# EAGLE design A4989 (EAGLE 7.7.0)
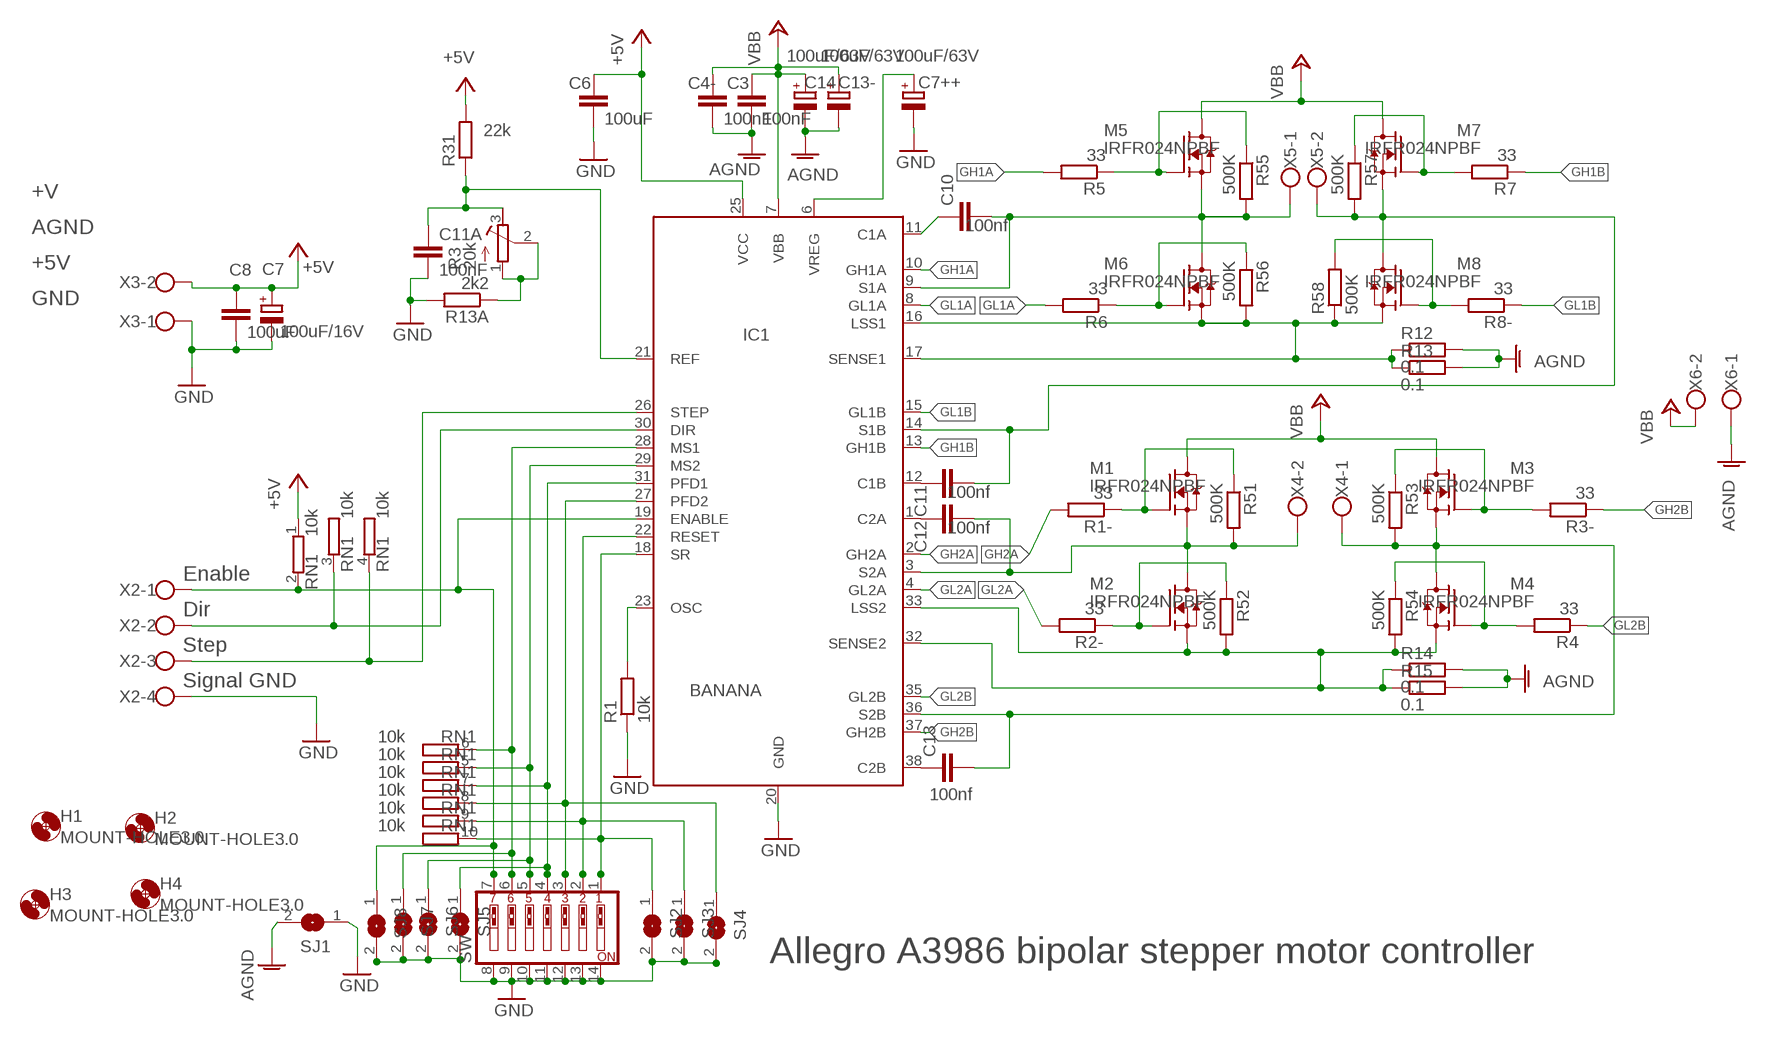
[diagram p0: schematic, sheet 1]

## Parts
C3  100nF  C-EUC0805  [C0805]
C4-  100nF  C-EUC0805  [C0805]
C6  100uF  C-EUC0805  [C0805]
C7  100uF/16V  CPOL-EUE5-10.5  [E5-10,5]
C7++  100uF/63V  CPOL-EUE2-5  [E2-5]
C8  100uF  C-EUC0805  [C0805]
C10  100nf  C-EUC0805  [C0805]
C11  100nf  C-EUC0805  [C0805]
C11A  100nF  C-EUC0805  [C0805]
C12  100nf  C-EUC0805  [C0805]
C13  100nf  C-EUC0805  [C0805]
C13-  100uF/63V  CPOL-EUE5-10.5  [E5-10,5]
C14  100uF/63V  CPOL-EUE5-10.5  [E5-10,5]
H1  MOUNT-HOLE3.0  [3,0]
H2  MOUNT-HOLE3.0  [3,0]
H3  MOUNT-HOLE3.0  [3,0]
H4  MOUNT-HOLE3.0  [3,0]
IC1  BANANA  A3986  [TSSOP38]
M1  IRFR024NPBF  [DPAK]
M2  IRFR024NPBF  [DPAK]
M3  IRFR024NPBF  [DPAK]
M4  IRFR024NPBF  [DPAK]
M5  IRFR024NPBF  [DPAK]
M6  IRFR024NPBF  [DPAK]
M7  IRFR024NPBF  [DPAK]
M8  IRFR024NPBF  [DPAK]
R1  10k  R-EU_M0805  [M0805]
R1-  33  R-EU_R0805  [R0805]
R2-  33  R-EU_R0805  [R0805]
R3  20k  R-TRIMM64W  [RTRIM64W]
R3-  33  R-EU_R0805  [R0805]
R4  33  R-EU_R0805  [R0805]
R5  33  R-EU_R0805  [R0805]
R6  33  R-EU_R0805  [R0805]
R7  33  R-EU_R0805  [R0805]
R8-  33  R-EU_R0805  [R0805]
R12  0.1  R-EU_R2512  [R2512]
R13  0.1  R-EU_R2512  [R2512]
R13A  2k2  R-EU_M0805  [M0805]
R14  0.1  R-EU_R2512  [R2512]
R15  0.1  R-EU_R2512  [R2512]
R31  22k  R-EU_M0805  [M0805]
R51  500K  R-EU_R0805  [R0805]
R52  500K  R-EU_R0805  [R0805]
R53  500K  R-EU_R0805  [R0805]
R54  500K  R-EU_R0805  [R0805]
R55  500K  R-EU_R0805  [R0805]
R56  500K  R-EU_R0805  [R0805]
R57  500K  R-EU_R0805  [R0805]
R58  500K  R-EU_R0805  [R0805]
RN1  10k  GE09RP  [SIL10]
SJ1  SJ  [SJ]
SJ2  SJ  [SJ]
SJ3  SJ  [SJ]
SJ4  SJ  [SJ]
SJ5  SJ  [SJ]
SJ6  SJ  [SJ]
SJ7  SJ  [SJ]
SJ8  SJ  [SJ]
SW  SW_DIP-7  [EDG-07]
X2  W237-4  [W237-4]
X3  W237-102  [W237-102]
X4  W237-102  [W237-102]
X5  W237-102  [W237-102]
X6  W237-102  [W237-102]

## Nets
+5V: C6.1 C7.+ C8.1 IC1.25(VCC) R31.2 RN1.1 X3.2
+24V: C3.1 C4-.1 C13-.+ C14.+ IC1.7(VBB) M1.4(D) M3.4(D) M5.4(D) M7.4(D) X6.2 ; supply symbol labelled VBB
AGND: C3.2 C4-.2 C13-.- C14.- R12.2 R13.2 R14.2 R15.2 SJ1.2 X6.1
GH1A: IC1.10(GH1A) R5.2
GH1B: IC1.13(GH1B) R7.1
GH2A: IC1.2(GH2A) R1-.2
GH2B: IC1.37(GH2B) R3-.1
GL1A: IC1.8(GL1A) R6.2
GL1B: IC1.15(GL1B) R8-.1
GL2A: IC1.4(GL2A) R2-.2
GL2B: IC1.35(GL2B) R4.1
GND: C6.2 C7++.- C7.- C8.2 C11A.2 IC1.20(GND) R1.1 R13A.2 SJ1.1 SJ2.2 SJ3.2 SJ4.2 SJ5.2 SJ6.2 SJ7.2 SJ8.2 SW.8 SW.9 SW.10 SW.11 SW.12 SW.13 SW.14 X2.4 X3.1
N$1: IC1.27(PFD2) RN1.8 SJ4.1 SW.3
N$2: R3.1(E) R3.2(S) R13A.1
N$3: IC1.28(MS1) RN1.6 SJ7.1 SW.6
N$4: C11A.1 IC1.21(REF) R3.3(A) R31.1
N$5: IC1.29(MS2) RN1.5 SJ6.1 SW.5
N$6: IC1.23(OSC) R1.2
N$7: C7++.+ IC1.6(VREG)
N$8: IC1.31(PFD1) RN1.7 SJ5.1 SW.4
N$9: M5.1(G) R5.1 R55.1
N$10: IC1.16(LSS1) IC1.17(SENSE1) M6.3(S) M8.3(S) R12.1 R13.1 R56.2 R58.1
N$11: IC1.32(SENSE2) IC1.33(LSS2) M2.3(S) M4.3(S) R14.1 R15.1 R52.2 R54.2
N$12: M6.1(G) R6.1 R56.1
N$13: M8.1(G) R8-.2 R58.2
N$15: M7.1(G) R7.2 R57.1
N$16: M1.1(G) R1-.1 R51.1
N$17: IC1.18(SR) RN1.10 SJ2.1 SW.1
N$18: M2.1(G) R2-.1 R52.1
N$19: IC1.22(RESET) RN1.9 SJ3.1 SW.2
N$20: M4.1(G) R4.2 R54.1
N$21: M3.1(G) R3-.2 R53.1
N$22: IC1.26(STEP) RN1.4 X2.3
N$23: C10.2 IC1.9(S1A) M5.3(S) M6.4(D) R55.2 X5.1
N$24: IC1.30(DIR) RN1.3 X2.2
N$26: C11.2 IC1.14(S1B) M7.3(S) M8.4(D) R57.2 X5.2
N$27: C12.2 IC1.3(S2A) M1.3(S) M2.4(D) R51.2 X4.2
N$28: C13.2 IC1.36(S2B) M3.3(S) M4.4(D) R53.2 X4.1
N$29: IC1.19(ENABLE) RN1.2 SJ8.1 SW.7 X2.1
N$30: C10.1 IC1.11(C1A)
N$31: C11.1 IC1.12(C1B)
N$32: C12.1 IC1.1(C2A)
N$33: C13.1 IC1.38(C2B)

## Notes on the sheet
- +V
- AGND
- +5V
- GND
- Enable
- Dir
- Step
- Signal GND
- Allegro A3986 bipolar stepper motor controller

## Library data of the parts
C3 C4- C6 C8 C10 C11 C11A C12 C13 = resistor:C-EU: CAPACITOR, European symbol
C7 = rcl:CPOL-EU: POLARIZED CAPACITOR, European symbol
C7++ C13- C14 = resistor:CPOL-EU: POLARIZED CAPACITOR, European symbol
H1-H4 = holes:MOUNT-HOLE: MOUNTING HOLE with drill center marker
IC1 = allegro2:A3986: Dual Full-Bridge MOSFET Driver with Microstepping Translator
M1-M8 = smd-special:IRFR024NPBF: N-CHANNEL POWER MOSFET
R1 R1- R2- R3- R4-R7 R8- R12 R13 R13A R14 R15 R31 R51-R58 = rcl:R-EU_: RESISTOR, European symbol
R3 = rcl:R-TRIMM: Trimm resistor
RN1 = resistor-sil:GE09RP: SIL RESISTOR
SJ1-SJ8 = jumper:SJ: SMD solder JUMPER
SW = special:SW_DIP-7: DIP SWITCH
X2 = con-wago-500:W237-4: WAGO SCREW CLAMP
X3-X6 = con-wago-500@1:W237-102: WAGO SCREW CLAMP; MPN: 237-102; OC_FARNELL: unknown; OC_NEWARK: 70K9898

## Net classes
1 V+: width 1.27 mm
2 GND: width 0.508 mm
3 AGND: width 1.778 mm
4 Motor: width 1.27 mm
5 5V: width 0.61 mm
6 none1: width 0.406 mm
7 none2: width 0.406 mm

## Board
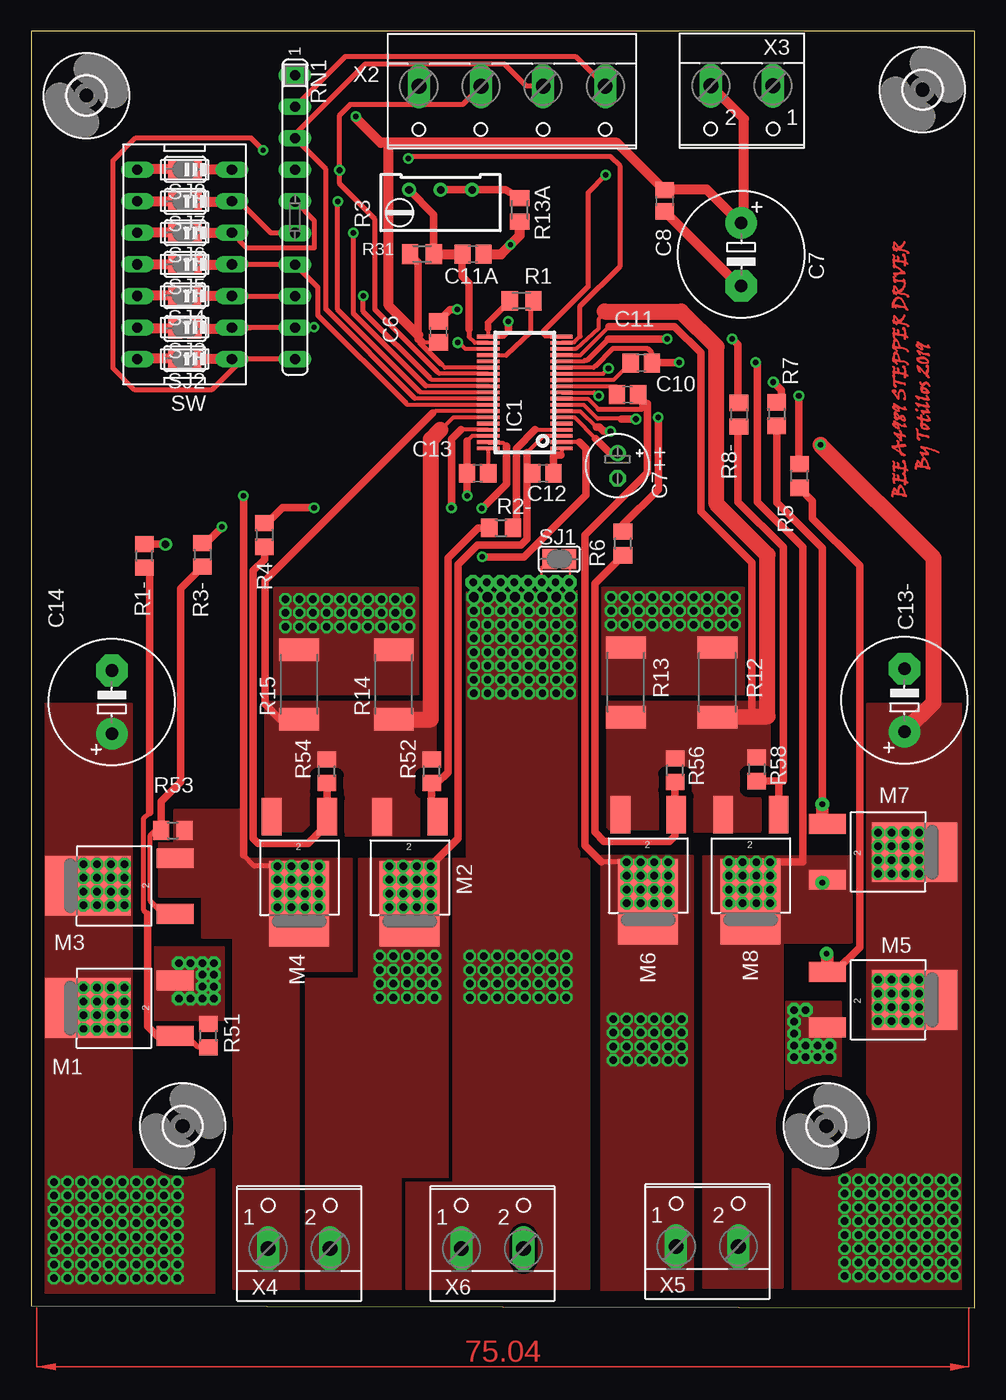
[diagram p1: board, top side]
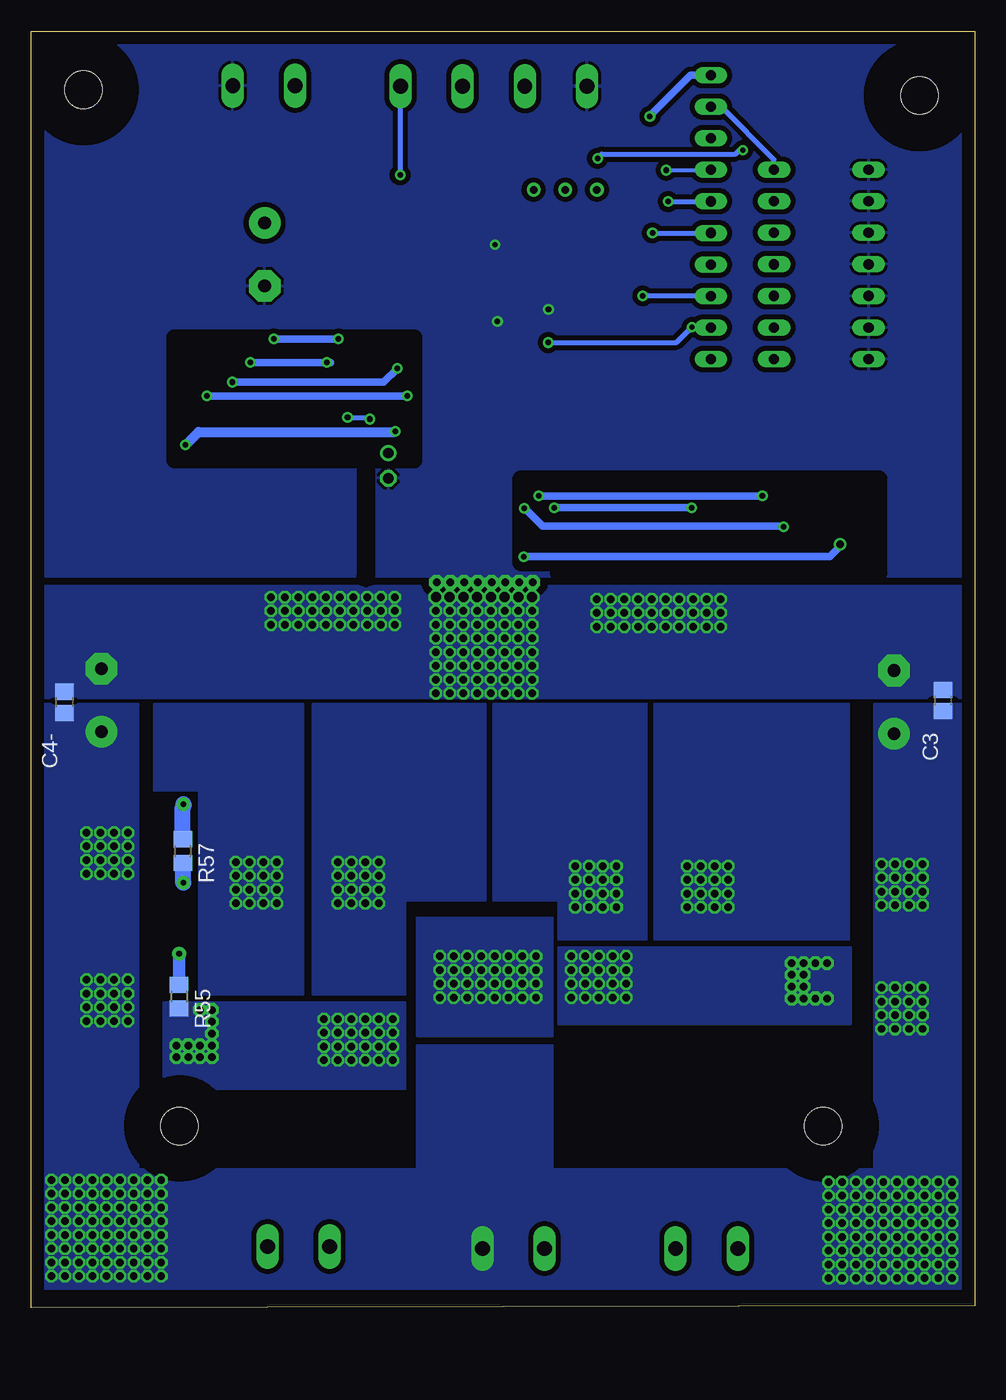
[diagram p2: board, bottom side, seen from below]

Size 75.98 x 102.77 mm. Coordinates in mm from the lower left corner, seen from the top.
Outline: 0,102.76 0,0.16 75.99,0 75.99,102.76 0,102.76
Copper layers (1*16): Top 0.035mm / dielectric 1.5mm / Bottom 0.035mm
Design rules "default *": minimum track width 8mil, minimum drill 0.4mm, track to track 6mil, track to pad 6mil, pad to pad 6mil, via to via 6mil, smd to smd 12mil, copper to edge 40mil, drill to drill 8mil, minimum pad ring 10mil, minimum via ring 8mil, stop-mask expansion 4mil, vias tented up to drill 0mil, thermal gap 10mil
bRestrict: area 7.7,59.2 to 36.5,66.7; area 45.1,58.9 to 64.5,78.1

### Footprints (pad centres in the part's own frame; a part is rotated, then mirrored left to right if it is on the bottom)
C0805 = smd 1.3 x 1.5: 1 -0.85,0; 2 0.85,0
E5-10,5 = drill 1.016 pad 2.54: + -2.54,0 | drill 1.016 pad 2.54 octagon: - 2.54,0
E2-5 = drill 0.813 pad 1.27: + -1.016,0 | drill 0.813 pad 1.27 octagon: - 1.016,0
3,0 = hole 3: 0,0
TSSOP38 = smd 0.3 x 1.8: 1 0,0; 2 0.5,0; 3 1,0; 4 1.5,0; 5 2,0; 6 2.5,0; 7 3,0; 8 3.5,0; 9 4,0; 10 4.5,0; 11 5,0; 12 5.5,0; 13 6,0; 14 6.5,0; 15 7,0; 16 7.5,0; 17 8,0; 18 8.5,0; 19 9,0; 20 9,5.9; 21 8.5,5.9; 22 8,5.9; 23 7.5,5.9; 24 7,5.9; 25 6.5,5.9; 26 6,5.9; 27 5.5,5.9; 28 5,5.9; 29 4.5,5.9; 30 4,5.9; 31 3.5,5.9; 32 3,5.9; 33 2.5,5.9; 34 2,5.9; 35 1.5,5.9; 36 1,5.9; 37 0.5,5.9; 38 0,5.9
DPAK = smd 1.6 x 2.997: 1 -2.261,-4.928; 3 2.21,-4.928 | smd 4.826 x 6.858: 4 0,2.083
M0805 = smd 1.3 x 1.6: 1 -0.95,0; 2 0.95,0
R0805 = smd 1.3 x 1.5: 1 -0.95,0; 2 0.95,0
RTRIM64W = drill 0.61: 1 1.27,-2.54; 2 1.27,0; 3 1.27,2.54
R2512 = smd 1.8 x 3.2: 1 -2.8,0; 2 2.8,0
SIL10 = drill 0.813 long: 1 -11.43,0; 2 -8.89,0; 3 -6.35,0; 4 -3.81,0; 5 -1.27,0; 6 1.27,0; 7 3.81,0; 8 6.35,0; 9 8.89,0; 10 11.43,0
SJ = smd 1.168 x 1.6: 1 -0.762,0; 2 0.762,0
EDG-07 = drill 0.813 long: 1 -7.62,-3.81; 2 -5.08,-3.81; 3 -2.54,-3.81; 4 0,-3.81; 5 2.54,-3.81; 6 5.08,-3.81; 7 7.62,-3.81; 8 7.62,3.81; 9 5.08,3.81; 10 2.54,3.81; 11 0,3.81; 12 -2.54,3.81; 13 -5.08,3.81; 14 -7.62,3.81
W237-4 = drill 1.194 long: 1 -7.5,-1.27; 2 -2.5,-1.27; 3 2.5,-1.27; 4 7.5,-1.27
W237-102 = drill 1.194 long: 1 -2.5,-1.27; 2 2.5,-1.27

### Placement (x,y rotation side)
C3  2.56,48.87 90 bottom
C4-  73.3,48.73 90 bottom
C6  32.8,78.55 90 top
C7  57.17,84.78 270 top
C7++  47.22,67.77 270 top
C8  51.01,89.1 270 top
C10  48.03,73.5 0 top
C11  49.13,76.04 0 top
C11A  35.58,84.8 0 top
C12  41.22,67.17 180 top
C13  35.96,67.15 180 top
C13-  70.32,48.9 90 top
C14  6.5,48.75 90 top
H1  12.2,14.62 0 top
H2  64.03,14.62 0 top
H3  71.77,98.04 0 top
H4  4.46,97.57 0 top
IC1  42.71,69.17 90 top
M1  6.67,24.12 90 top
M2  30.48,34.6 180 top
M3  6.67,33.96 90 top
M4  21.59,34.6 180 top
M5  69.04,24.76 270 top
M6  49.68,34.76 180 top
M7  69.04,36.66 270 top
M8  57.93,34.76 180 top
R1  39.5,81.05 0 top
R1-  9.14,60.52 90 top
R2-  37.84,62.77 0 top
R3  32.97,88.71 90 top
R3-  13.81,60.61 270 top
R4  18.8,62.2 270 top
R5  61.87,66.95 90 top
R6  47.65,61.51 90 top
R7  60.03,71.93 270 top
R8-  56.99,71.88 270 top
R12  55.26,50.34 90 top
R13  47.89,50.34 90 top
R13A  39.35,88.37 270 top
R14  29.21,50.16 90 top
R15  21.59,50.16 90 top
R31  31.47,84.82 180 top
R51  14.29,21.9 90 top
R52  32.26,43.17 90 top
R53  11.43,38.42 0 top
R54  23.81,43.17 90 top
R55  64.07,25.03 270 bottom
R56  51.85,43.26 90 top
R57  63.77,36.75 270 bottom
R58  58.42,43.33 270 top
RN1  21.25,87.78 270 top
SJ1  42.53,60.26 0 top
SJ2  12.37,76.39 180 top
SJ3  12.4,78.82 180 top
SJ4  12.37,81.46 180 top
SJ5  12.4,83.98 180 top
SJ6  12.4,86.53 180 top
SJ7  12.4,89.05 180 top
SJ8  12.4,91.63 180 top
SW  12.36,83.98 90 top
X2  38.73,97.06 180 top
X3  57.23,97.09 180 top
X4  21.59,6.02 0 top
X5  54.44,6.18 0 top
X6  37.15,6.02 0 top

### Tracks (layer width: path | path; a pad name or v marks a point on that pad's centre or on a via)
+5V  (via drill 0.45)
  Top 0.305: IC1.25 33.31,75.67 33.06,75.92 | C6.1 31.64,77.7 31.28,77.7 31.16,77.82
  Top 0.406: 33.06,75.92 31.28,77.7 | 31.16,77.98 31.16,78.17 31.64,77.7 | 31.16,77.82 31.16,78.29
  Top 0.61: R31.2 31.16,84.18 31.16,77.98
  Top 0.813: 31.16,78.29 28.79,80.66 28.79,93.78 | 57.24,87.16 54.4,90.01 51.07,90.01 C8.1 47.18,93.78 28.79,93.78 | 57.24,87.16 57.24,87.25 C7.+ | 28.79,93.78 28.15,93.78 26.16,95.76 v26.16,95.9 | 57.24,87.16 57.4,87.32 57.4,95.7 X3.2
  Bottom 0.61: RN1.1 22.89,99.21 26.16,95.94 v26.16,95.9
+24V  (via drill 0.45, 0.6 pad 0.8)
  Top 0.305: IC1.7 44.21,72.17 45.51,70.87
  Top 0.61: 45.51,70.87 45.76,70.87 46.08,70.55 v46.65,70.55
  Top 1.27: v63.55,69.44 72.67,60.33 72.67,48.7 C13-.+
  Bottom 0.813: v63.55,69.44 62.51,70.49 46.71,70.49 v46.65,70.55
  other vias: 4.2,35.71 5.31,35.71 6.42,35.71 7.52,35.71 7.52,34.6 6.42,34.6 5.31,34.6 4.2,34.6 4.2,33.5 5.31,33.5 6.42,33.5 7.52,33.5 7.52,32.39 6.42,32.39 5.31,32.39 4.2,32.39 4.2,25.75 5.31,25.75 6.42,25.75 7.52,25.75 7.52,24.65 6.42,24.65 5.31,24.65 4.2,24.65 4.2,23.54 5.31,23.54 6.42,23.54 7.52,23.54 7.52,22.44 6.42,22.44 5.31,22.44 4.2,22.44 68.19,38.24 69.3,38.24 70.41,38.24 71.51,38.24 71.51,37.13 70.41,37.13 69.3,37.13 68.19,37.13 68.19,36.02 69.3,36.02 70.41,36.02 71.51,36.02 71.51,34.92 70.41,34.92 69.3,34.92 68.19,34.92 65.51,10.27 65.51,9.16 65.51,8.06 65.51,6.95 65.51,5.85 65.51,4.74 65.51,3.63 65.51,2.53 66.61,10.27 67.72,10.27 68.83,10.27 69.93,10.27 69.93,9.16 68.83,9.16 67.72,9.16 66.61,9.16 66.61,8.06 67.72,8.06 68.83,8.06 69.93,8.06 69.93,6.95 68.83,6.95 67.72,6.95 66.61,6.95 71.04,10.27 72.14,10.27 73.25,10.27 74.36,10.27 74.36,9.16 73.25,9.16 72.14,9.16 71.04,9.16 71.04,8.06 72.14,8.06 73.25,8.06 74.36,8.06 74.36,6.95 73.25,6.95 72.14,6.95 71.04,6.95 66.61,5.85 67.72,5.85 68.83,5.85 69.93,5.85 69.93,4.74 68.83,4.74 67.72,4.74 66.61,4.74 66.61,3.63 67.72,3.63 68.83,3.63 69.93,3.63 69.93,2.53 68.83,2.53 67.72,2.53 66.61,2.53 71.04,5.85 72.14,5.85 73.25,5.85 74.36,5.85 74.36,4.74 73.25,4.74 72.14,4.74 71.04,4.74 71.04,3.63 72.14,3.63 73.25,3.63 74.36,3.63 74.36,2.53 73.25,2.53 72.14,2.53 71.04,2.53 1.83,10.11 1.83,9.01 1.83,7.9 1.83,6.79 1.83,5.69 1.83,4.58 1.83,3.48 1.83,2.37 2.94,10.11 4.05,10.11 5.15,10.11 6.26,10.11 6.26,9.01 5.15,9.01 4.05,9.01 2.94,9.01 2.94,7.9 4.05,7.9 5.15,7.9 6.26,7.9 6.26,6.79 5.15,6.79 4.05,6.79 2.94,6.79 7.36,10.11 8.47,10.11 9.58,10.11 10.68,10.11 10.68,9.01 9.58,9.01 8.47,9.01 7.36,9.01 7.36,7.9 8.47,7.9 9.58,7.9 10.68,7.9 10.68,6.79 9.58,6.79 8.47,6.79 7.36,6.79 2.94,5.69 4.05,5.69 5.15,5.69 6.26,5.69 6.26,4.58 5.15,4.58 4.05,4.58 2.94,4.58 2.94,3.48 4.05,3.48 5.15,3.48 6.26,3.48 6.26,2.37 5.15,2.37 4.05,2.37 2.94,2.37 7.36,5.69 8.47,5.69 9.58,5.69 10.68,5.69 10.68,4.58 9.58,4.58 8.47,4.58 7.36,4.58 7.36,3.48 8.47,3.48 9.58,3.48 10.68,3.48 10.68,2.37 9.58,2.37 8.47,2.37 7.36,2.37 11.79,10.11 11.79,9.01 11.79,7.9 11.79,6.79 11.79,5.69 11.79,4.58 11.79,3.48 11.79,2.37 68.19,26.39 69.3,26.39 70.41,26.39 71.51,26.39 71.51,25.28 70.41,25.28 69.3,25.28 68.19,25.28 68.19,24.17 69.3,24.17 70.41,24.17 71.51,24.17 71.51,23.07 70.41,23.07 69.3,23.07 68.19,23.07
  pour Top (no thermals): 61.34,11.14 67.35,11.14 67.35,48.59 75.09,48.59 75.09,1.5 61.34,1.5
  pour Top (no thermals): 14.73,0.87 1.14,0.87 1.14,48.59 8.1,48.59 8.1,11.14 14.73,11.14
  pour Bottom (isolate 0.406, no thermals): 75.56,48.59 75.56,1.5 1.14,1.5 1.14,48.59 8.1,48.59 8.1,11.14 14.73,11.14 34.01,11.14 34.01,21.1 44.91,21.1 44.91,11.14 67.35,11.14 67.35,48.59
AGND  (via drill 0.6 pad 0.8, 0.8 pad 0.8)
  Top 0.203: v43.39,57.2 43.39,59.54 43.29,59.63 SJ1.2
  other vias: 35.65,57.2 36.75,57.2 37.86,57.2 38.96,57.2 38.96,56.09 37.86,56.09 36.75,56.09 35.65,56.09 35.65,54.98 36.75,54.98 37.86,54.98 38.96,54.98 38.96,53.88 37.86,53.88 36.75,53.88 35.65,53.88 40.07,57.2 41.18,57.2 42.28,57.2 43.39,56.09 42.28,56.09 41.18,56.09 40.07,56.09 40.07,54.98 41.18,54.98 42.28,54.98 43.39,54.98 43.39,53.88 42.28,53.88 41.18,53.88 40.07,53.88 35.65,52.77 36.75,52.77 37.86,52.77 38.96,52.77 38.96,51.67 37.86,51.67 36.75,51.67 35.65,51.67 35.65,50.56 36.75,50.56 37.86,50.56 38.96,50.56 38.96,49.45 37.86,49.45 36.75,49.45 35.65,49.45 40.07,52.77 41.18,52.77 42.28,52.77 43.39,52.77 43.39,51.67 42.28,51.67 41.18,51.67 40.07,51.67 40.07,50.56 41.18,50.56 42.28,50.56 43.39,50.56 43.39,49.45 42.28,49.45 41.18,49.45 40.07,49.45 22.69,57.04 23.8,57.04 24.9,57.04 26.01,57.04 26.01,55.93 24.9,55.93 23.8,55.93 22.69,55.93 22.69,54.83 23.8,54.83 24.9,54.83 26.01,54.83 27.11,57.04 28.22,57.04 29.33,57.04 30.43,57.04 30.43,55.93 29.33,55.93 28.22,55.93 27.11,55.93 27.11,54.83 28.22,54.83 29.33,54.83 30.43,54.83 46.71,57.2 47.81,57.2 48.92,57.2 50.02,57.2 50.02,56.09 48.92,56.09 47.81,56.09 46.71,56.09 46.71,54.98 47.81,54.98 48.92,54.98 50.02,54.98 51.13,57.2 52.24,57.2 53.34,57.2 54.45,57.2 54.45,56.09 53.34,56.09 52.24,56.09 51.13,56.09 51.13,54.98 52.24,54.98 53.34,54.98 54.45,54.98 20.48,57.04 21.58,57.04 21.58,55.93 20.48,55.93 20.48,54.83 21.58,54.83 55.55,57.2 56.66,57.2 56.66,56.09 55.55,56.09 55.55,54.98 56.66,54.98 35.33,28.28 36.44,28.28 37.54,28.28 38.65,28.28 38.65,27.18 37.54,27.18 36.44,27.18 35.33,27.18 35.33,26.07 36.44,26.07 37.54,26.07 38.65,26.07 38.65,24.96 37.54,24.96 36.44,24.96 35.33,24.96 39.75,28.28 40.86,28.28 41.97,28.28 43.07,28.28 43.07,27.18 41.97,27.18 40.86,27.18 39.75,27.18 39.75,26.07 40.86,26.07 41.97,26.07 43.07,26.07 43.07,24.96 41.97,24.96 40.86,24.96 39.75,24.96
  pour Top (isolate 0.254, no thermals): 30.22,1.5 30.22,10.04 34.01,10.04 34.01,36.11 35.11,36.11 35.11,57.91 44.12,57.91 44.12,36.11 44.91,36.11 44.91,1.5
  pour Top (no thermals): 19.63,57.91 19.63,49.38 31.16,49.38 31.16,57.91
  pour Top (no thermals): 46.02,57.91 57.39,57.91 57.39,49.38 46.02,49.38
  pour Bottom: 34.01,31.37 34.01,21.89 44.91,21.89 44.91,31.37
  pour Bottom (isolate 0.61, no thermals): 1.14,58.07 1.14,49.06 75.09,49.06 75.09,58.07
GH1A  (via drill 0.45)
  Top 0.305: IC1.10 45.34,73.67 45.62,73.39
  Top 0.406: 45.62,73.39 v45.7,73.39
  Top 0.61: v61.82,73.39 61.82,67.95 R5.2
  Bottom 0.61: v61.82,73.39 v45.7,73.39
GH1B  (via drill 0.45)
  Top 0.305: IC1.13 46.05,75.17 v46.49,75.61 | 60.39,73.24 R7.1
  Top 0.61: 60.39,73.24 60.39,73.87 v59.76,74.5
  Bottom 0.61: v46.49,75.61 47.6,74.5 v59.76,74.5
GH2A  (via drill 0.45, 0.61)
  Top 0.305: 44.16,69.66 42.72,69.66 IC1.2
  Top 0.406: 9.15,61.45 R1-.2
  Top 0.61: v10.83,61.45 9.15,61.45 | v36.32,60.44 36.34,60.42 39.67,60.42 44.68,65.43 44.68,69.14 44.16,69.66
  Bottom 0.305: v10.83,61.45 10.83,61.3
  Bottom 0.406: 36.3,60.47 36.3,60.46 v36.32,60.44
  Bottom 0.61: 36.3,60.47 11.67,60.47 10.83,61.3
GH2B  (via drill 0.45)
  Top 0.305: IC1.37 36.85,69.63 37.99,69.63 38.27,69.34 | 14.09,61.56 R3-.1
  Top 0.406: 36.34,64.35 v36.27,64.35
  Top 0.61: 38.27,69.34 38.27,66.28 36.34,64.35 | v15.38,62.85 14.09,61.56
  Bottom 0.61: v15.38,62.85 15.44,62.91 34.8,62.91 36.24,64.35 v36.27,64.35
GL1A  (via drill 0.45)
  Top 0.305: 47.52,71.56 45.61,71.56 44.5,72.67 IC1.8
  Top 0.406: R6.2 47.65,63.02 | 47.55,71.53 47.52,71.56
  Top 0.61: v48.7,71.53 47.55,71.53 | 47.65,63.02 50.5,65.87 v50.5,71.66
  Bottom 0.406: v50.5,71.66 48.83,71.66 v48.7,71.53
GL1B  (via drill 0.45)
  Top 0.305: 44.59,76.24 44.52,76.17 IC1.15
  Top 0.406: 46.49,77.98 44.75,76.24 44.59,76.24 | R8-.1 56.92,72.9
  Top 0.61: v51.23,77.98 46.49,77.98 | 56.92,72.9 56.92,77.5 v56.44,77.98
  Bottom 0.61: v56.44,77.98 v51.23,77.98
GL2A
  Top 0.305: 40.59,70.67 IC1.4
  Top 0.61: R2-.2 39.09,63.06 39.09,69.17 40.59,70.67
GL2B  (via drill 0.45)
  Top 0.305: IC1.35 34.6,70.67 | 19.02,63.15 R4.1
  Top 0.61: v33.85,64.39 33.85,69.92 34.6,70.67 | 19.02,63.15 20.26,64.39 v22.79,64.39
  Bottom 0.61: v33.85,64.39 27.69,64.39 v22.79,64.39
GND  (via drill 0.4, 0.45, 0.6 pad 1.2)
  Top 0.203: SJ1.1 41.11,59.6 v41.11,58.39 v41.12,58.38
  Top 0.305: 37.99,78.17 IC1.20 36.81,78.74 36.79,78.76 | v38.62,85.57 38.57,85.53 38.57,85.52
  Top 0.406: 37.99,78.17 38.43,78.61
  Top 0.508: R1.1 36.79,79.29 36.79,78.76
  Top 0.61: C6.2 33.75,80.35 v34.32,80.35 | 38.43,78.61 v38.43,79.4
  Top 0.813: C7.- 57.02,82.24 C8.2 | C11A.2 37.85,84.8 38.57,85.52 39.35,86.3 R13A.2 | SJ8.2 8.58,91.63 SW.8 | SJ7.2 8.57,89.05 SW.9 | SJ6.2 SW.10 | SJ5.2 SW.11 | SJ4.2 8.57,81.46 SW.12 | SJ3.2 8.64,78.82 SW.13 | SJ2.2 8.58,76.39 SW.14
  other vias: 35.59,58.38 36.69,58.38 37.8,58.38 38.91,58.38 40.01,58.38 42.22,58.38 43.33,58.38
  pour Bottom (isolate 0.406): 1.14,102.31 1.14,58.86 75.09,58.86 75.09,102.31
N$1  (via drill 0.45)
  Top 0.305: IC1.27 32.26,74.67 32.11,74.82 | 21.24,81.44 RN1.8
  Top 0.406: 32.11,74.82 26.74,80.19 v26.74,81.45 | SW.3 21.24,81.44
  Top 0.813: SJ4.1 16.16,81.46 SW.3
  Bottom 0.305: 21.18,81.5 RN1.8 | 26.24,81.43 26.27,81.45
  Bottom 0.406: RN1.8 26.24,81.43 | 26.27,81.45 v26.74,81.45
N$2
  Top 0.61: R3.2 R3.1 38.19,89.98 R13A.1
N$3  (via drill 0.45)
  Top 0.305: IC1.28 36.79,74.18 31.8,74.18
  Top 0.406: 31.8,74.18 25.95,80.03 v25.95,86.51 | RN1.6 19.32,86.51 16.77,89.06 SW.6
  Top 0.813: SJ7.1 SW.6
  Bottom 0.305: RN1.6
  Bottom 0.406: v25.95,86.51 RN1.6
N$4
  Top 0.305: IC1.21 35.74,77.67 35.27,78.13
  Top 0.406: 35.27,78.79 35.27,78.13
  Top 0.61: R31.1 32.42,87.99 R3.3 | C11A.1 34.69,84.76 34.69,83.05 35.27,82.46 35.27,78.79
  Top 0.813: R31.1 34.72,84.82 C11A.1
N$5  (via drill 0.45)
  Top 0.305: IC1.29 31.36,73.67 31.32,73.71
  Top 0.406: 31.32,73.71 24.69,80.35 v24.69,89.04 | RN1.5 22.81,87.49 22.81,85.29 17.4,85.29 SW.5
  Top 0.813: SJ6.1 SW.5
  Bottom 0.305: 21.26,89.04 RN1.5
  Bottom 0.406: v24.69,89.04 21.26,89.04
N$6
  Top 0.305: IC1.23 38.26,76.67
  Top 0.406: 38.26,76.67 40.22,78.48 40.24,78.49 40.24,80.84 R1.2
N$7
  Top 0.305: IC1.6 43.75,71.67 45.46,69.96
  Top 0.61: 45.46,69.96 46.63,68.79 C7++.+
N$8
  Top 0.305: IC1.31 30.31,72.67 30.22,72.76 | 21.18,84.04 RN1.7 21.3,83.91 21.24,83.98
  Top 0.406: 30.22,72.76 23.11,79.87 23.11,82.11 21.3,83.91 | SW.4 21.24,83.98
  Top 0.813: SJ5.1 SW.4
N$9  (via drill 0.45 pad 1.1)
  Top 0.61: M5.1 64.73,27.02 66.71,29 66.71,58.54 66.71,59.73 62.92,63.52 62.92,64.89 62.92,64.95 R5.1 61.87,66.12
  Top 1.016: M5.1 64.12,28.48 v64.06,28.48
  Bottom 1.016: v64.06,28.48 R55.1
N$10
  Top 0.305: IC1.17 43.87,77.17 45.7,78.81 45.7,79.56 46.17,80.03 | 46.54,78.98 44.23,76.67 IC1.16
  Top 0.61: 46.54,78.98 51.81,78.98 53.92,76.87 53.92,64.07 58.02,59.97 58.02,47.57 | 48.07,80.35 47.75,80.03 46.17,80.03 46.17,80.19
  Top 1.27: R12.1 58.03,47.57 58.18,47.58 59.29,47.59 | 58.02,47.57 59.29,47.59 | 59.29,47.59 59.29,60.6 55.18,64.7 55.18,77.34 52.34,80.19 46.17,80.19
  pour Top (isolate 0.61, no thermals): 45.86,48.75 45.86,38.32 59.45,38.32 59.45,48.75
N$11
  Top 0.305: 33.22,70.87 34.02,71.67 IC1.33 | 32.31,72.01 32.38,72.01 32.54,72.17 IC1.32
  Top 0.61: 32.31,72.01 18.84,58.54 18.84,48.59 20.07,47.36 R15.1 | 32.94,70.64 32.94,70.65 33.15,70.87 33.22,70.87
  Top 1.27: R14.1 32.19,47.36 32.19,69.89 32.94,70.64
  pour Top (isolate 0.61, no thermals): 18.25,38 18.25,48.75 33.38,48.75 33.38,38
N$12
  Top 0.61: M6.1 51.85,39.69 R56.1 51.85,37.99 51.39,37.53 46.13,37.53 45.38,38.27 45.38,58.29 R6.1
N$13
  Top 0.406: R58.2 60.19,42.38 | R8-.2 56.9,70.85
  Top 0.61: 60.19,42.38 M8.1 | R58.2 60.55,42.38 60.55,61.23 56.92,64.86 56.92,68.91 56.9,70.85
N$15  (via drill 0.45 pad 1.1)
  Top 0.61: v63.71,40.53 63.71,61.13 60.03,64.82 R7.2
  Top 1.016: v63.71,40.53 63.71,39.33 63.87,39.17 M7.1
  Bottom 1.27: R57.1 63.77,40.29 63.71,40.35 v63.71,40.53
N$16
  Top 0.406: R51.1 13.46,20.95 12.52,21.89 11.62,21.89 | 11.62,21.89 M1.1 | 11.62,21.89 10.15,21.89 | 9.54,39.87 9.04,39.37 9.04,32.02 9.4,31.65 | 9.54,59.16 R1-.1
  Top 0.61: 10.15,21.89 9.4,22.63 9.4,31.65 | 9.54,39.87 9.54,59.16
N$17  (via drill 0.4, 0.45)
  Top 0.305: IC1.18 42.75,77.71 43.73,77.71 44.21,78.19
  Top 0.406: SW.1 21.24,76.36 RN1.10 17.02,76.35 14.53,73.86 8.35,73.86 6.6,75.62 6.6,92.34 8.44,94.18 14.48,94.17 17.68,94.17 v18.68,93.17 | 44.21,78.19 44.21,80.63 47.44,83.86 47.44,91.88 46.65,92.67 30.53,92.67 v30.37,92.51
  Top 0.813: SJ2.1 16.15,76.39 SW.1
  Bottom 0.406: v30.37,92.51 30.03,92.86 19.29,92.86 18.97,93.17 v18.68,93.17
N$18
  Top 0.406: R52.1 32.7,42.22
  Top 0.61: R52.1 32.26,39.53 M2.1 | 32.7,42.22 33.57,43.09 33.57,58.11 33.57,60.34 36,62.77 R2-.1
N$19  (via drill 0.4, 0.45)
  Top 0.203: 21.2,78.91 RN1.9
  Top 0.305: IC1.22 34.97,77.17 34.48,77.66 34.37,77.67 v34.35,77.69 | 21.21,78.92 21.2,78.91 | 17.71,78.9 17.73,78.92
  Top 0.406: v22.79,78.92 21.21,78.92 17.73,78.92 16.75,78.92 | SW.2 17.71,78.9
  Top 0.813: SJ3.1 16.09,78.82 SW.2
  Bottom 0.406: v34.35,77.69 24.03,77.69 v22.79,78.92
N$20
  Top 0.406: R54.1 23.81,38.87
  Top 0.61: R54.1 23.85,42.22 M4.1 | 23.81,38.87 22.32,37.37 18.28,37.37 17.89,37.76 17.89,59.33 18.8,60.24 R4.2
N$21
  Top 0.406: R53.1 10,38.42 9.6,38.02 9.6,32.74 10.65,31.7 M3.1
  Top 0.61: R53.1 10.48,40.75 12.05,42.32 12.05,57.9 R3-.2
N$22  (via drill 0.45)
  Top 0.305: IC1.26 32.87,75.17 32.74,75.29
  Top 0.406: 32.74,75.29 27.69,80.35 27.69,84.3 27.69,87.61 24.84,90.46 v24.84,91.56 24.84,96 25.68,96.84 34.74,96.84 X2.3
  Bottom 0.305: v24.84,91.56 21.27,91.56 RN1.4
N$23  (via drill 0.6 pad 0.8, 0.6 pad 1.1)
  Top 0.305: IC1.9 44.82,73.17 45.67,72.32
  Top 0.406: v47.97,35.87 45.94,35.87 | 45.67,72.32 49.18,72.32 49.18,73.21 C10.2 49.62,72.77
  Top 0.61: 45.94,35.87 44.59,37.21 44.59,62.18 49.62,67.2 49.62,72.77
  other vias: 61.42,23.96 62.38,23.96 61.42,23.01 61.42,22.06 61.42,21.1 62.38,21.1 63.33,21.1 64.28,21.1 61.42,20.15 62.38,20.15 63.33,20.15 64.28,20.15 49.08,35.87 50.18,35.87 51.29,35.87 51.29,34.76 50.18,34.76 49.08,34.76 47.97,34.76 47.97,33.65 49.08,33.65 50.18,33.65 51.29,33.65 51.29,32.55 50.18,32.55 49.08,32.55 47.97,32.55 46.86,23.23 47.97,23.23 49.08,23.23 50.18,23.23 50.18,22.12 49.08,22.12 47.97,22.12 46.86,22.12 46.86,21.01 47.97,21.01 49.08,21.01 50.18,21.01 50.18,19.91 49.08,19.91 47.97,19.91 46.86,19.91 51.29,23.23 52.39,23.23 52.39,22.12 51.29,22.12 51.29,21.01 52.39,21.01 52.39,19.91 51.29,19.91
  pour Top (no thermals): 45.87,36.34 45.87,1.42 53.33,1.42 53.33,36.34
  pour Top (no thermals): 65.23,24.6 60.79,24.6 60.79,17.61 65.23,17.61
  pour Bottom (no thermals): 65.29,24.57 65.29,17.62 45.86,17.62 45.86,24.57
  pour Bottom: 53.28,25.21 45.86,25.21 45.86,32.79 39.38,32.79 39.38,48.59 45.86,48.59 53.28,48.59
N$24
  Top 0.305: IC1.30 30.88,73.17 30.88,73.21
  Top 0.406: 30.88,73.21 23.74,80.36 23.74,91.64 RN1.3 21.25,94.44 26.9,100.1 38.12,100.1 39.89,98.33 X2.2
N$26  (via drill 0.45, 0.45 pad 1.1, 0.6 pad 0.8)
  Top 0.305: 45.38,75.76 45.29,75.67 IC1.14
  Top 0.406: C11.2 49.98,76.86 49.65,77.19 46.81,77.19 45.38,75.76
  Top 0.61: v56.19,35.87 62.13,35.87 62.13,56.65 62.13,61.23 58.5,64.86 58.5,75.92 v58.34,76.08 | v52.18,76.08 50.02,76.08 C11.2
  Bottom 0.61: v58.34,76.08 v52.18,76.08 51.86,76.08
  Bottom 1.27: 63.77,34.27 v63.71,34.21 63.77,34.27 R57.2
  other vias: 57.29,35.87 58.4,35.87 59.5,35.87 59.5,34.76 58.4,34.76 57.29,34.76 56.19,34.76 56.19,33.65 57.29,33.65 58.4,33.65 59.5,33.65 59.5,32.55 58.4,32.55 57.29,32.55 56.19,32.55
  pour Top (no thermals): 54.12,1.58 54.12,36.34 66.03,36.34 66.03,29.36 60.47,29.36 60.47,1.58
  pour Bottom: 54.07,25.21 62.45,25.21 62.45,41.64 66.08,41.64 66.08,48.59 54.07,48.59
N$27  (via drill 0.6 pad 0.8, 0.6 pad 1.1)
  Top 0.305: 39.92,68.84 41.25,70.17 IC1.3
  Top 0.61: v32.17,35.55 34.38,37.76 34.38,59.81 35.96,61.39 39.46,61.39 39.92,61.85 39.92,67.06 39.92,67.17 | 39.92,68.84 39.92,67.17 | C12.2 39.92,67.17
  other vias: 28.85,35.55 29.96,35.55 31.06,35.55 32.17,34.44 31.06,34.44 29.96,34.44 28.85,34.44 28.85,33.34 29.96,33.34 31.06,33.34 32.17,33.34 32.17,32.23 31.06,32.23 29.96,32.23 28.85,32.23 11.89,27.73 12.84,27.73 13.78,27.73 14.73,27.73 13.78,26.79 14.73,26.79 11.89,24.89 12.84,24.89 13.78,24.89 14.73,24.89 13.78,25.84 14.73,25.84 28.06,28.28 28.06,27.18 28.06,26.07 28.06,24.96 29.17,28.28 30.27,28.28 31.38,28.28 32.49,28.28 32.49,27.18 31.38,27.18 30.27,27.18 29.17,27.18 29.17,26.07 30.27,26.07 31.38,26.07 32.49,26.07 32.49,24.96 31.38,24.96 30.27,24.96 29.17,24.96
  pour Top (no thermals): 9.99,28.99 15.52,28.99 15.52,23.15 9.99,23.15
  pour Top (no thermals): 22.16,1.5 22.16,26.47 26.42,26.47 26.42,36.11 33.53,36.11 33.53,10.51 29.74,10.51 29.74,1.5
  pour Bottom: 9.99,28.84 9.99,22.84 33.53,22.84 33.53,29 9.99,29
  pour Bottom: 33.53,29.63 33.53,32.79 38.75,32.79 38.75,48.59 26.42,48.59 26.42,29.63
N$28  (via drill 0.45, 0.6 pad 0.8)
  Top 0.305: IC1.36 35.52,70.17 35.11,69.76
  Top 0.406: v23.16,35.55 17.98,35.55 17.1,36.42
  Top 0.61: 17.1,36.42 v17.1,65.34 | v35.11,65.34 C13.2 35.11,69.76
  Bottom 0.61: v17.1,65.34 26.9,65.34 v35.11,65.34
  other vias: 19.85,35.55 20.95,35.55 22.06,35.55 23.16,34.44 22.06,34.44 20.95,34.44 19.85,34.44 19.85,33.34 20.95,33.34 22.06,33.34 23.16,33.34 23.16,32.23 22.06,32.23 20.95,32.23 19.85,32.23
  pour Top (no thermals): 16.31,1.5 16.31,29.79 13.78,29.79 13.78,33.1 10.31,33.1 10.31,37.37 11.57,37.37 11.57,40.06 16.94,40.06 16.94,36.11 25.79,36.11 25.79,27.1 21.53,27.1 21.53,1.5
  pour Bottom: 25.79,29.63 25.79,48.59 10.15,48.59 10.15,29.63
N$29  (via drill 0.45)
  Top 0.305: IC1.19 41.4,78.17 41.28,78.29 41.28,78.61
  Top 0.406: 41.28,78.61 44.84,82.18 44.84,89.77 v46.27,91.19 | RN1.2 25.3,100.73 43.83,100.73 X2.1
  Top 0.813: SJ8.1 16.15,91.63 SW.7
  Bottom 0.203: 46.27,98.37 X2.1 | RN1.2 21.21,96.67 21.25,96.63
  Bottom 0.406: 46.27,98.37 v46.27,91.19 | 21.21,96.67 20.42,96.67 16.17,92.42 SW.7
N$30
  Top 0.305: IC1.11 47.12,74.17 47.12,73.56 C10.1
N$31
  Top 0.305: C11.1 46.91,74.67 IC1.12
N$32
  Top 0.305: IC1.1 42.71,68.65 42.67,68.65
  Top 0.61: 42.67,68.65 42.07,68.65 C12.1
N$33
  Top 0.305: 37.28,66.92 C13.1 IC1.38
(copper drawn outside any net)
  shapes: Top area x1823

### Text on the board
tDocu: Step | Dir | En | ENABLE | +5V | D GND | MS1 | MS2 | Pfd1 | Pfd2 | RS | A3986 | SR | 27nF | 470 | 55V MAX | A A- B B- | MOTOR | - +